# Altium schematic sheet MR26_GSS_1.SchDoc
size 337 x 296 mm; Origin: Eagle; OriginPath: C:\Users\David Nguyen\Downloads\eagle\eagle\MR26_GSS.sch; OriginSheet: 2; OriginDescription: 03 Point-of-load regulators 1V1 / 2V5 / 3V3
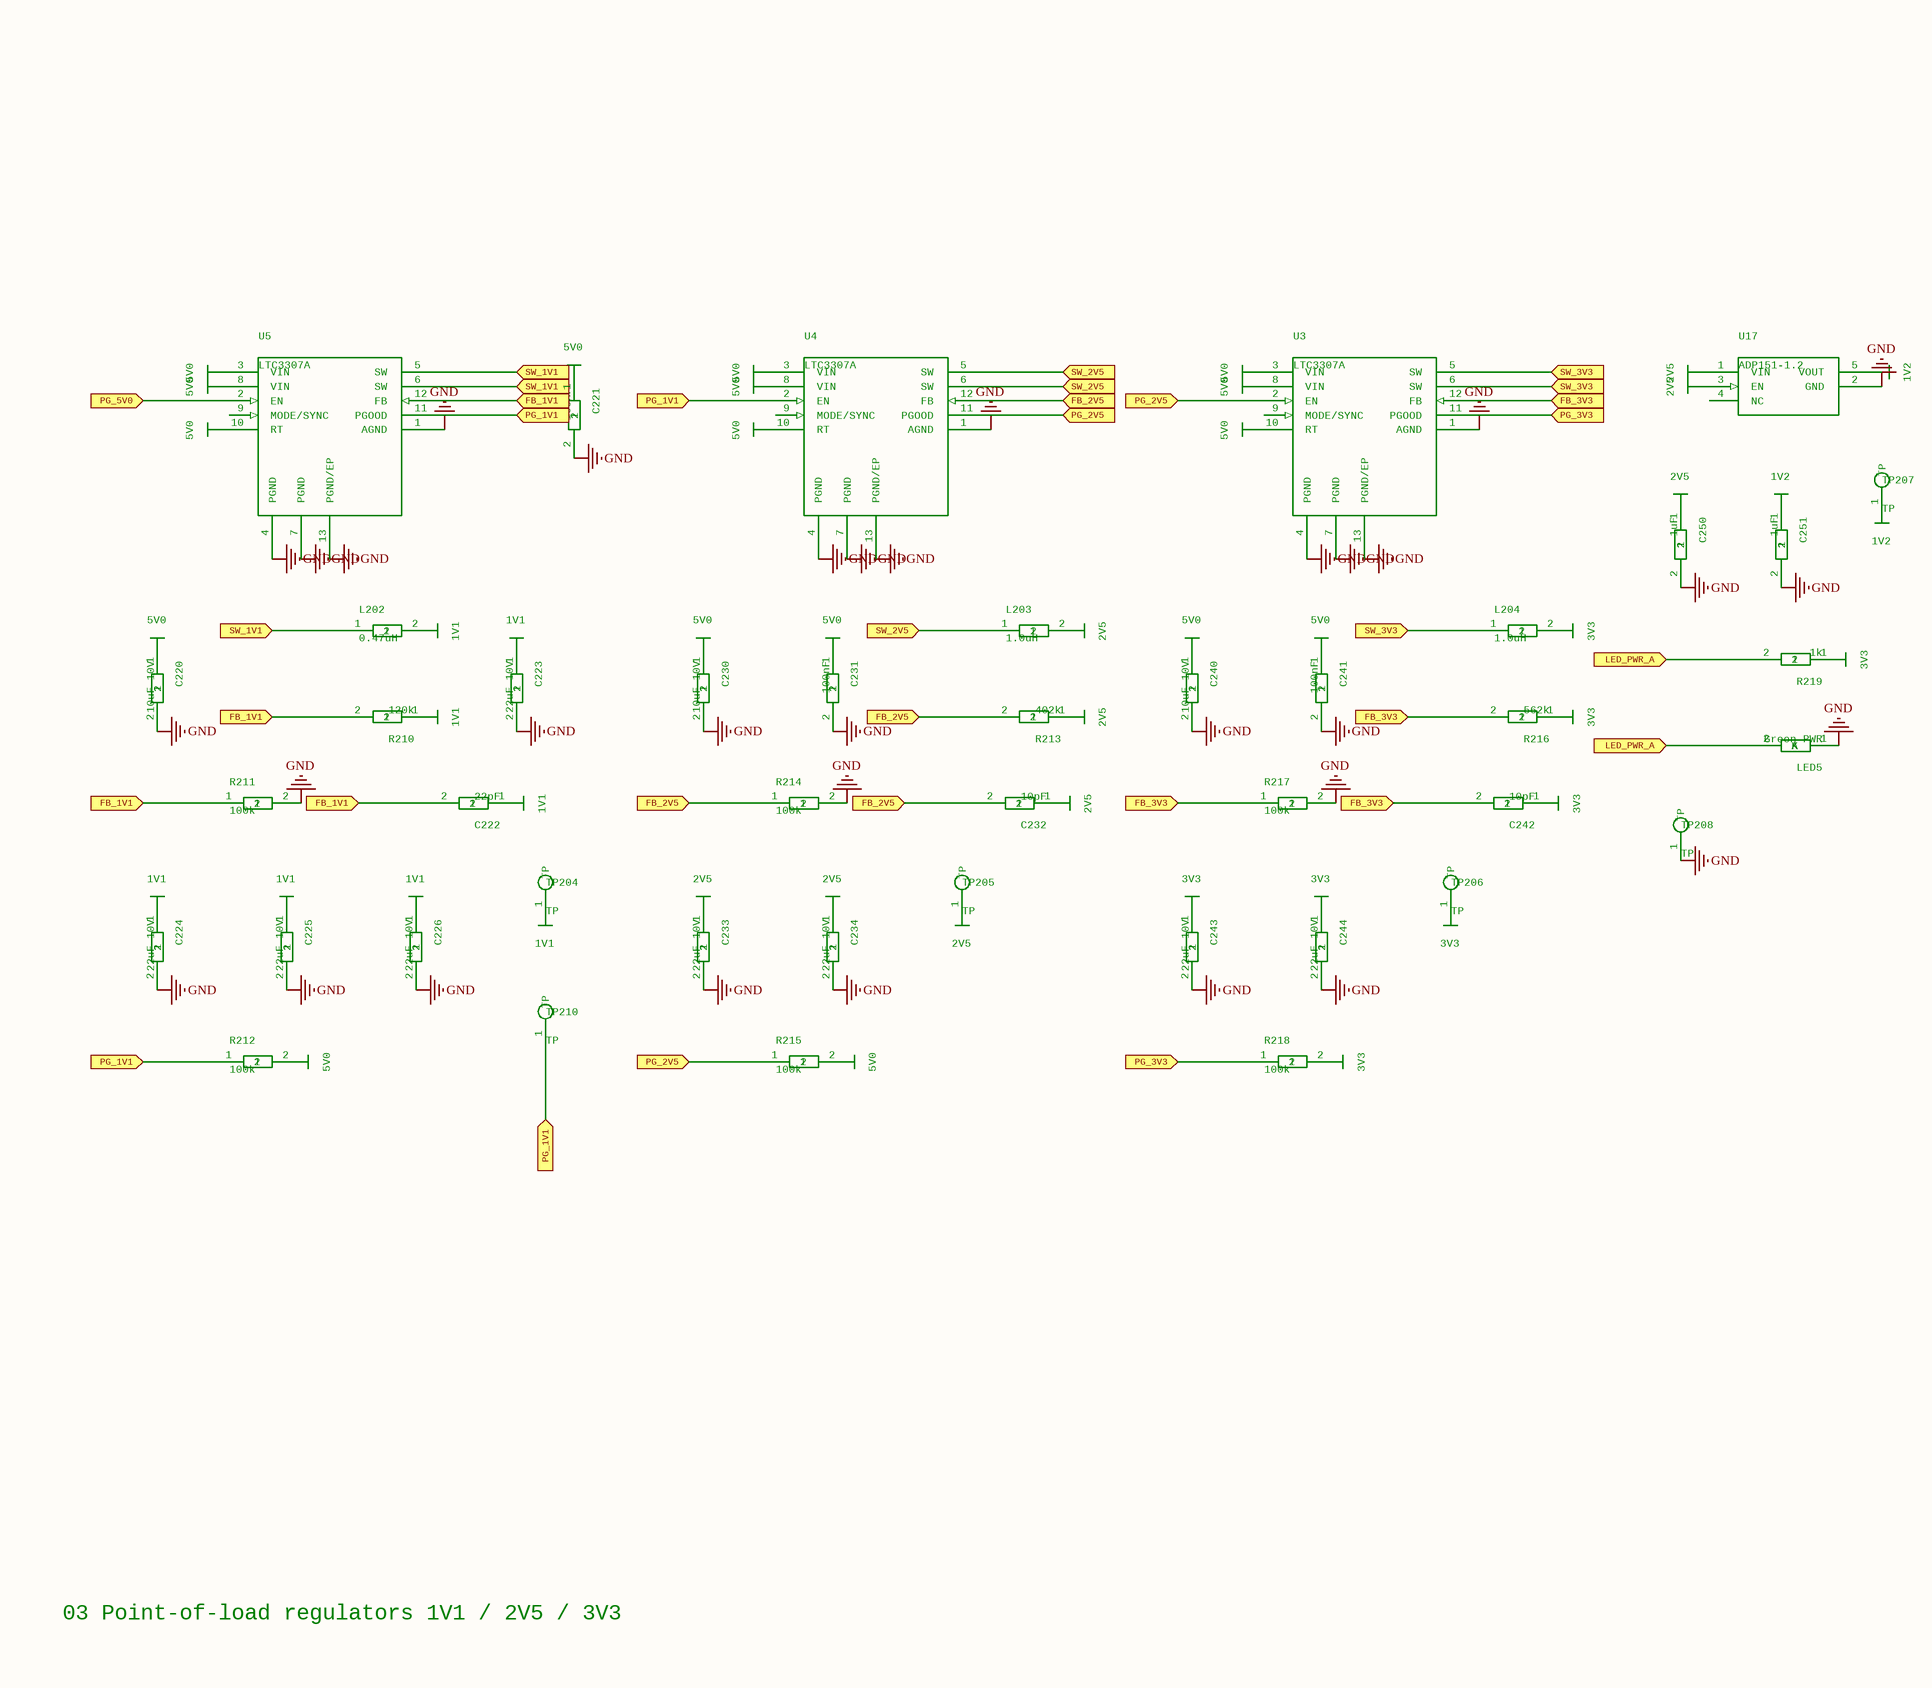
[diagram p0: MR26_GSS_1.SchDoc]

## Parts
C220  10uF 10V  [C_0603]
C221  100nF  [C_0402]
C222  22pF  [C_0402]
C223  22uF 10V  [C_0805]
C224  22uF 10V  [C_0805]
C225  22uF 10V  [C_0805]
C226  22uF 10V  [C_0805]
C230  10uF 10V  [C_0603]
C231  100nF  [C_0402]
C232  10pF  [C_0402]
C233  22uF 10V  [C_0805]
C234  22uF 10V  [C_0805]
C240  10uF 10V  [C_0603]
C241  100nF  [C_0402]
C242  10pF  [C_0402]
C243  22uF 10V  [C_0805]
C244  22uF 10V  [C_0805]
C250  1uF  [C_0402]
C251  1uF  [C_0402]
L202  0.47uH  [L_4x4]
L203  1.0uH  [L_4x4]
L204  1.0uH  [L_4x4]
LED5  Green PWR  [LED_0603]
PWR0064  5V0
PWR0065  5V0
PWR0066  5V0
PWR0071  5V0
PWR0073  5V0
PWR0075  1V1
PWR0076  1V1
PWR0078  1V1
PWR0079  1V1
PWR0081  1V1
PWR0083  1V1
PWR0085  1V1
PWR0087  5V0
PWR0088  1V1
PWR0089  5V0
PWR0090  5V0
PWR0091  5V0
PWR0096  5V0
PWR0098  5V0
PWR0100  2V5
PWR0101  2V5
PWR0103  2V5
PWR0104  2V5
PWR0106  2V5
PWR0108  5V0
PWR0109  2V5
PWR0110  5V0
PWR0111  5V0
PWR0112  5V0
PWR0117  5V0
PWR0119  5V0
PWR0121  3V3
PWR0122  3V3
PWR0124  3V3
PWR0125  3V3
PWR0127  3V3
PWR0129  3V3
PWR0130  3V3
PWR0131  2V5
PWR0132  2V5
PWR0133  1V2
PWR0135  2V5
PWR0137  1V2
PWR0139  1V2
PWR0140  3V3
R210  120k  [R_0402]
R211  100k  [R_0402]
R212  100k  [R_0402]
R213  402k  [R_0402]
R214  100k  [R_0402]
R215  100k  [R_0402]
R216  562k  [R_0402]
R217  100k  [R_0402]
R218  100k  [R_0402]
R219  1k  [R_0402]
TP204  TP  [TP_1.0mm]
TP205  TP  [TP_1.0mm]
TP206  TP  [TP_1.0mm]
TP207  TP  [TP_1.0mm]
TP208  TP  [TP_1.0mm]
TP210  TP  [TP_1.0mm]
U3  LTC3307A  [LQFN-12_2x2]
U4  LTC3307A  [LQFN-12_2x2]
U5  LTC3307A  [LQFN-12_2x2]
U17  ADP151-1.2  [TSOT-23-5]

## Ports
FB_1V1 (in), FB_2V5 (in), FB_3V3 (in), LED_PWR_A (in), PG_1V1 (in), PG_2V5 (in), PG_3V3 (in), PG_5V0 (in), SW_1V1 (in), SW_2V5 (in), SW_3V3 (in)

## Nets
GND: C220.2 C221.2 C223.2 C224.2 C225.2 C226.2 C230.2 C231.2 C233.2 C234.2 C240.2 C241.2 C243.2 C244.2 C250.2 C251.2 LED5.1(K) R211.2 R214.2 R217.2 TP208.1(TP) U3.1(AGND) U3.4(PGND) U3.7(PGND) U3.13(PGND/EP) U4.1(AGND) U4.4(PGND) U4.7(PGND) U4.13(PGND/EP) U5.1(AGND) U5.4(PGND) U5.7(PGND) U5.13(PGND/EP) U17.2(GND)
FB_1V1: C222.2 R210.2 R211.1 U5.12(FB) ; port FB_1V1
FB_2V5: C232.2 R213.2 R214.1 U4.12(FB) ; port FB_2V5
FB_3V3: C242.2 R216.2 R217.1 U3.12(FB) ; port FB_3V3
LED_PWR_A: LED5.2(A) R219.2 ; port LED_PWR_A
PG_1V1: R212.1 TP210.1(TP) U4.2(EN) U5.11(PGOOD) ; port PG_1V1
PG_2V5: R215.1 U3.2(EN) U4.11(PGOOD) ; port PG_2V5
PG_3V3: R218.1 U3.11(PGOOD) ; port PG_3V3
PG_5V0: U5.2(EN) ; port PG_5V0
SW_1V1: L202.1 U5.5(SW) U5.6(SW) ; port SW_1V1
SW_2V5: L203.1 U4.5(SW) U4.6(SW) ; port SW_2V5
SW_3V3: L204.1 U3.5(SW) U3.6(SW) ; port SW_3V3
NetC220_1: C220.1 PWR0071.?1(5V0)
NetC221_1: C221.1 PWR0073.?1(5V0)
NetC222_1: C222.1 PWR0078.?1(1V1)
NetC223_1: C223.1 PWR0079.?1(1V1)
NetC224_1: C224.1 PWR0081.?1(1V1)
NetC225_1: C225.1 PWR0083.?1(1V1)
NetC226_1: C226.1 PWR0085.?1(1V1)
NetC230_1: C230.1 PWR0096.?1(5V0)
NetC231_1: C231.1 PWR0098.?1(5V0)
NetC232_1: C232.1 PWR0103.?1(2V5)
NetC233_1: C233.1 PWR0104.?1(2V5)
NetC234_1: C234.1 PWR0106.?1(2V5)
NetC240_1: C240.1 PWR0117.?1(5V0)
NetC241_1: C241.1 PWR0119.?1(5V0)
NetC242_1: C242.1 PWR0124.?1(3V3)
NetC243_1: C243.1 PWR0125.?1(3V3)
NetC244_1: C244.1 PWR0127.?1(3V3)
NetC250_1: C250.1 PWR0135.?1(2V5)
NetC251_1: C251.1 PWR0137.?1(1V2)
NetL202_2: L202.2 PWR0075.?1(1V1)
NetL203_2: L203.2 PWR0100.?1(2V5)
NetL204_2: L204.2 PWR0121.?1(3V3)
NetPWR0064_?1: PWR0064.?1(5V0) U5.3(VIN)
NetPWR0065_?1: PWR0065.?1(5V0) U5.8(VIN)
NetPWR0066_?1: PWR0066.?1(5V0) U5.10(RT)
NetPWR0076_?1: PWR0076.?1(1V1) R210.1
NetPWR0087_?1: PWR0087.?1(5V0) R212.2
NetPWR0088_?1: PWR0088.?1(1V1) TP204.1(TP)
NetPWR0089_?1: PWR0089.?1(5V0) U4.3(VIN)
NetPWR0090_?1: PWR0090.?1(5V0) U4.8(VIN)
NetPWR0091_?1: PWR0091.?1(5V0) U4.10(RT)
NetPWR0101_?1: PWR0101.?1(2V5) R213.1
NetPWR0108_?1: PWR0108.?1(5V0) R215.2
NetPWR0109_?1: PWR0109.?1(2V5) TP205.1(TP)
NetPWR0110_?1: PWR0110.?1(5V0) U3.3(VIN)
NetPWR0111_?1: PWR0111.?1(5V0) U3.8(VIN)
NetPWR0112_?1: PWR0112.?1(5V0) U3.10(RT)
NetPWR0122_?1: PWR0122.?1(3V3) R216.1
NetPWR0129_?1: PWR0129.?1(3V3) R218.2
NetPWR0130_?1: PWR0130.?1(3V3) TP206.1(TP)
NetPWR0131_?1: PWR0131.?1(2V5) U17.1(VIN)
NetPWR0132_?1: PWR0132.?1(2V5) U17.3(EN)
NetPWR0133_?1: PWR0133.?1(1V2) U17.5(VOUT)
NetPWR0139_?1: PWR0139.?1(1V2) TP207.1(TP)
NetPWR0140_?1: PWR0140.?1(3V3) R219.1

Not connected (* = marked no-connect by the designer): U3 9(MODE/SYNC); U4 9(MODE/SYNC); U5 9(MODE/SYNC); U17 4(NC)

## Notes on the sheet
- 03 Point-of-load regulators 1V1 / 2V5 / 3V3

## Library data of the parts
C220 C230 C240 = CAPC_0603: MPN: CAP 10uF 10V 0603; GateName_1: G$1; SymbolName_1: CAP; DeviceName: C_0603; LibraryName: MR26; DeviceSetName: CAP
C221 C231 C241 = CAPC_0402: MPN: CAP 100nF 0402; GateName_1: G$1; SymbolName_1: CAP; DeviceName: C_0402; LibraryName: MR26; DeviceSetName: CAP
C222 = CAPC_0402: MPN: CAP 22pF 0402; GateName_1: G$1; SymbolName_1: CAP; DeviceName: C_0402; LibraryName: MR26; DeviceSetName: CAP
C223-C226 C233 C234 C243 C244 = CAPC_0805: MPN: CAP 22uF 10V 0805; GateName_1: G$1; SymbolName_1: CAP; DeviceName: C_0805; LibraryName: MR26; DeviceSetName: CAP
C232 C242 = CAPC_0402: MPN: CAP 10pF 0402; GateName_1: G$1; SymbolName_1: CAP; DeviceName: C_0402; LibraryName: MR26; DeviceSetName: CAP
C250 C251 = CAPC_0402: MPN: CAP 1uF 0402; GateName_1: G$1; SymbolName_1: CAP; DeviceName: C_0402; LibraryName: MR26; DeviceSetName: CAP
L202 = INDL_4x4: MPN: Coilcraft XFL4015-471MEC; GateName_1: G$1; SymbolName_1: IND; DeviceName: L_4x4; LibraryName: MR26; DeviceSetName: IND
L203 L204 = INDL_4x4: MPN: Coilcraft XFL4020-102MEC; GateName_1: G$1; SymbolName_1: IND; DeviceName: L_4x4; LibraryName: MR26; DeviceSetName: IND
LED5 = LEDLED_0603: MPN: Wurth 150060GS75000; GateName_1: G$1; SymbolName_1: LED; DeviceName: LED_0603; LibraryName: MR26; DeviceSetName: LED
PWR0064 PWR0065 PWR0066 PWR0071 PWR0073 PWR0087 PWR0089 PWR0090 PWR0091 PWR0096 PWR0098 PWR0108 PWR0110 PWR0111 PWR0112 PWR0117 PWR0119 = PWR_5V0: GateName_1: G$1; SymbolName_1: PWR_5V0; LibraryName: MR26; DeviceSetName: PWR_5V0
PWR0075 PWR0076 PWR0078 PWR0079 PWR0081 PWR0083 PWR0085 PWR0088 = PWR_1V1: GateName_1: G$1; SymbolName_1: PWR_1V1; LibraryName: MR26; DeviceSetName: PWR_1V1
PWR0100 PWR0101 PWR0103 PWR0104 PWR0106 PWR0109 PWR0131 PWR0132 PWR0135 = PWR_2V5: GateName_1: G$1; SymbolName_1: PWR_2V5; LibraryName: MR26; DeviceSetName: PWR_2V5
PWR0121 PWR0122 PWR0124 PWR0125 PWR0127 PWR0129 PWR0130 PWR0140 = PWR_3V3: GateName_1: G$1; SymbolName_1: PWR_3V3; LibraryName: MR26; DeviceSetName: PWR_3V3
PWR0133 PWR0137 PWR0139 = PWR_1V2: GateName_1: G$1; SymbolName_1: PWR_1V2; LibraryName: MR26; DeviceSetName: PWR_1V2
R210 = RESR_0402: MPN: RES 120k 0402; GateName_1: G$1; SymbolName_1: RES; DeviceName: R_0402; LibraryName: MR26; DeviceSetName: RES
R211 R212 R214 R215 R217 R218 = RESR_0402: MPN: RES 100k 0402; GateName_1: G$1; SymbolName_1: RES; DeviceName: R_0402; LibraryName: MR26; DeviceSetName: RES
R213 = RESR_0402: MPN: RES 402k 0402; GateName_1: G$1; SymbolName_1: RES; DeviceName: R_0402; LibraryName: MR26; DeviceSetName: RES
R216 = RESR_0402: MPN: RES 562k 0402; GateName_1: G$1; SymbolName_1: RES; DeviceName: R_0402; LibraryName: MR26; DeviceSetName: RES
R219 = RESR_0402: MPN: RES 1k 0402; GateName_1: G$1; SymbolName_1: RES; DeviceName: R_0402; LibraryName: MR26; DeviceSetName: RES
TP204-TP208 TP210 = TESTPOINTTP_1.0mm: MPN: Keystone 5019 / 1.0 mm pad; GateName_1: G$1; SymbolName_1: TESTPOINT; DeviceName: TP_1.0mm; LibraryName: MR26; DeviceSetName: TESTPOINT
U3-U5 = LTC3307A_LQFN12LQFN-12_2x2: MPN: LTC3307AJV#TRMPBF; GateName_1: G$1; SymbolName_1: LTC3307A_LQFN12; DeviceName: LQFN-12_2x2; LibraryName: MR26; DeviceSetName: LTC3307A_LQFN12
U17 = ADP151_TSOT5TSOT-23-5: MPN: ADP151AUJZ-1.2-R7; GateName_1: G$1; SymbolName_1: ADP151_TSOT5; DeviceName: TSOT-23-5; LibraryName: MR26; DeviceSetName: ADP151_TSOT5